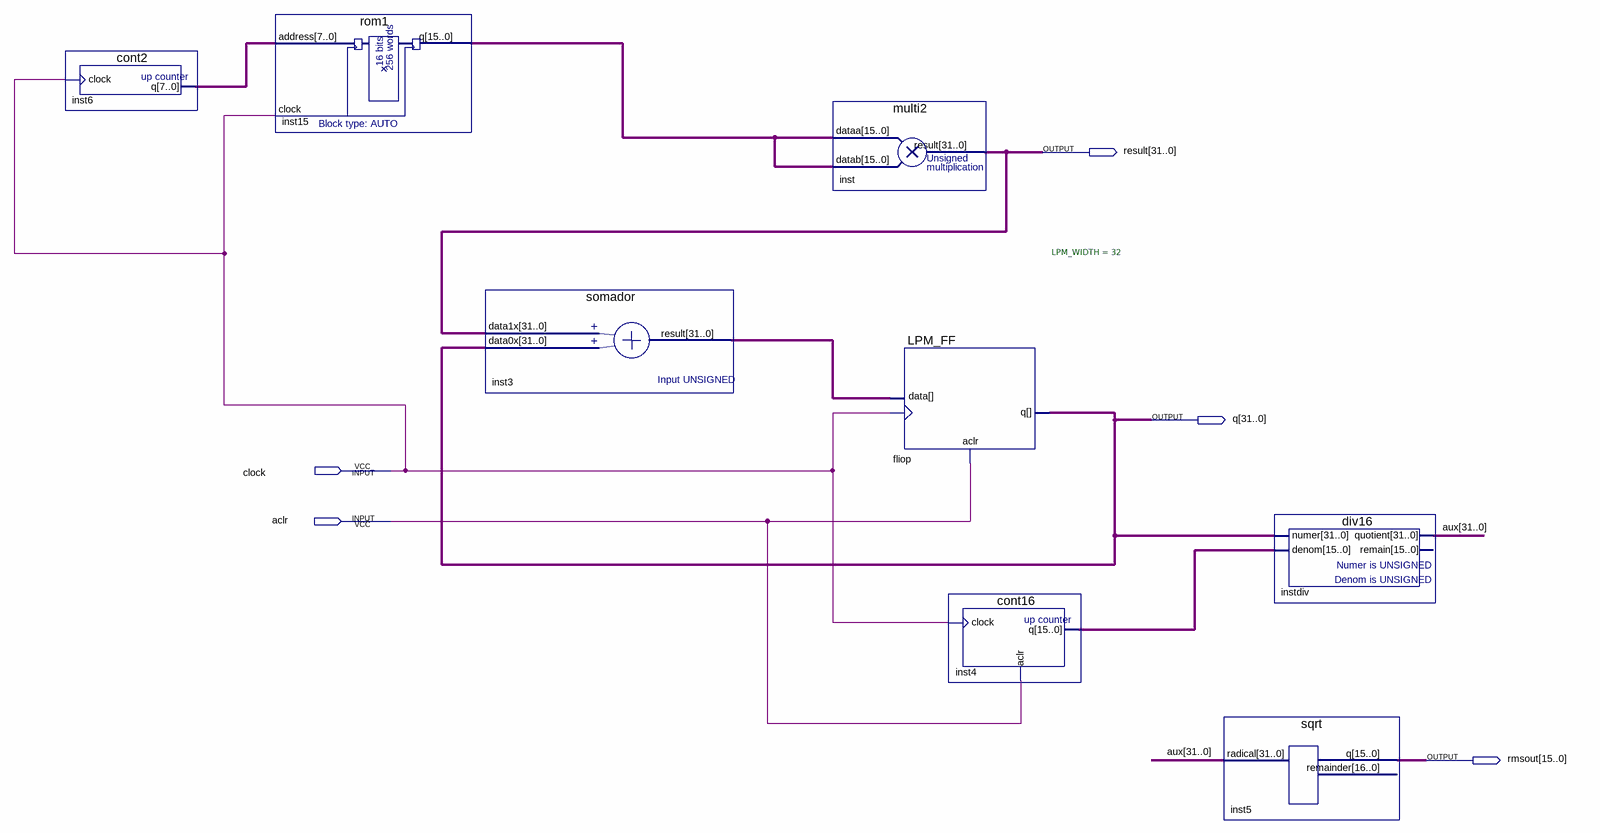
[diagram p0: schematic sheet]
// Quartus schematic rms.bdf as structural Verilog: 8 symbols, 5 pins
module rms (
  input  clock,
  input  aclr,
  output [31:0] result,
  output [31:0] q,
  output [15:0] rmsout
);

  wire [7:0] inst6_q;
  wire [15:0] inst4_q, inst15_q;
  wire [31:0] aux, inst3_result;

  cont2 inst6 (.clock(clock), .q(inst6_q));
  rom1 inst15 (.address(inst6_q), .clock(clock), .q(inst15_q));
  somador inst3 (.data1x(result), .data0x(q), .result(inst3_result));
  multi2 inst (.dataa(inst15_q), .datab(inst15_q), .result(result));
  LPM_FF #(.LPM_WIDTH(32)) fliop (.aclr(aclr), .clock(clock), .data(inst3_result), .q(q));
  cont16 inst4 (.clock(clock), .aclr(aclr), .q(inst4_q));
  sqrt inst5 (.radical(aux), .q(rmsout));  // open: remainder
  div16 instdiv (.numer(q), .denom(inst4_q), .quotient(aux));  // open: remain
endmodule
